# EAGLE schematic Inductance_meter (EAGLE 6.4)
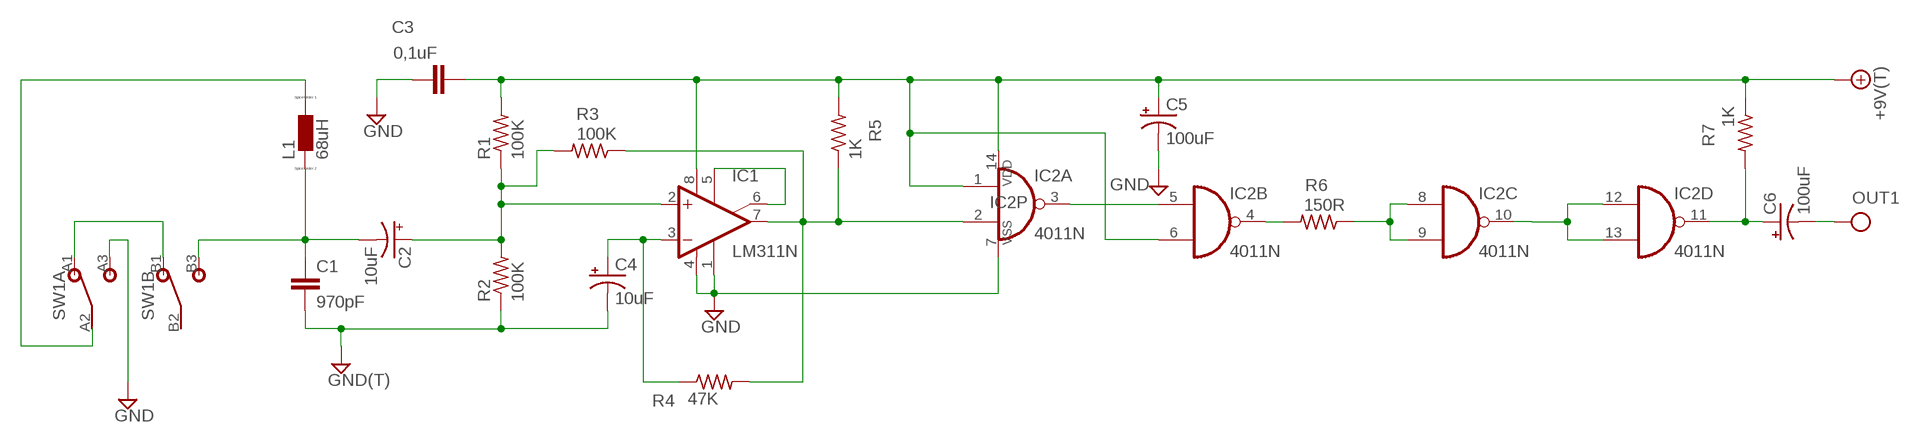
[diagram p0: schematic, sheet 1]

## Parts
+9V1  +9V(T)  [SQUARE]
C1  970pF  072X0252  [072X025]
C2  10uF  0502  [050_020_2]
C3  0,1uF  072X0252  [072X025]
C4  10uF  0502  [050_020_2]
C5  100uF  0502  [050_020_2]
C6  100uF  0502  [050_020_2]
GND1  GND(T)  [SQUARE]
IC1  LM311N  [DIL08]
IC2  4011N  [DIL14]
L1  68uH  L0207/10  [0207/10]
OUT1  OUT(T)  [SQUARE]
R1  100K  6MM.3  [R0207/3]
R2  100K  6MM.3  [R0207/3]
R3  100K  6MM.3  [R0207/3]
R4  47K  6MM.3  [R0207/3]
R5  1K  6MM.3  [R0207/3]
R6  150R  6MM.3  [R0207/3]
R7  1K  6MM.3  [R0207/3]
SW1  DPDT  [DPDT]

## Nets
+9V: +9V1.1(+9V) C3.2 C5.+ IC1.8(V+) IC2.1(A:I0) IC2.6(B:I1) IC2.14(P:VDD) R1.2 R5.2 R7.1
GND: C1.2 C3.1 C4.- C5.- GND1.1(GND) IC1.1(GND) IC1.4(V-) IC2.7(P:VSS) R2.1 SW1.A3
N$1: L1.1 SW1.A2
N$2: C1.1 C2.- L1.2 SW1.B3
N$3: SW1.A1 SW1.B1
N$5: IC1.7(OUT) IC2.2(A:I1) R3.1 R4.2 R5.1
N$6: C2.+ IC1.2(+IN) R1.1 R2.2 R3.2
N$7: IC2.4(B:O) R6.2
N$8: IC1.5(ON) IC1.6(ON/STR)
N$9: C4.+ IC1.3(-IN) R4.1
N$11: IC2.3(A:O) IC2.5(B:I0)
N$12: IC2.8(C:I0) IC2.9(C:I1) R6.1
N$13: IC2.10(C:O) IC2.12(D:I0) IC2.13(D:I1)
N$14: C6.+ IC2.11(D:O) R7.2
OUT: C6.- OUT1.1(OUT)
Unconnected: SW1.B2

## Library data of the parts
+9V1 = gm-supply:+9V(T): +9V Voltage Supply use this to hook up +9v throughout a schematic instead of running wire automatically labels the net "+9v" adds a hookup pad to the circuit board
C1 C3 = gm-caps-film-box:072X025: 1000pF - 0.47uF WIMA MKP2 63, 100V: 1000pF - 0.015uF; MKS2 50V: 0.33 - 0.47uF; 63V: 1000pF - 0.22uF;
C2 C4-C6 = gm-caps-electro-pol:050: 0.22 - 100uF Xicon values at Mouser.com: 10V: 10 - 100uF; 16V: 2.2 - 47uF; 25V: 0.47 - 47uF; 50V: 0.22 - 22uF
GND1 = gm-supply:GND(T): Ground use this to hook up ground (GND) throughout a schematic instead of running wire automatically labels the net "GND" adds a hookup pad to the circuit board (you can use several)
IC1 = linear:LM311: COMPARATOR
IC2 = 40xx:4011: Quad 2-input NAND
L1 = eagle-ltspice:L: INDUCTOR, European symbol; SPICEMODEL: NONE; SPICEPREFIX: L
OUT1 = gm-supply:OUT(T): Output obsolete: use Pad instead and label net output label with circuit board terminal/pad usually appears only once on a schematic
R1-R7 = gm-resistors:6MM: 6mm Resistors Leads spaced 1-6 holes apart for 0.1" perfboard. Suitable for 1/4 watt resistors.
SW1 = gm-switches:DPDT